# Altium schematic sheet Sheet1.SchDoc
size B; SheetNumber: 1; SheetTotal: 1
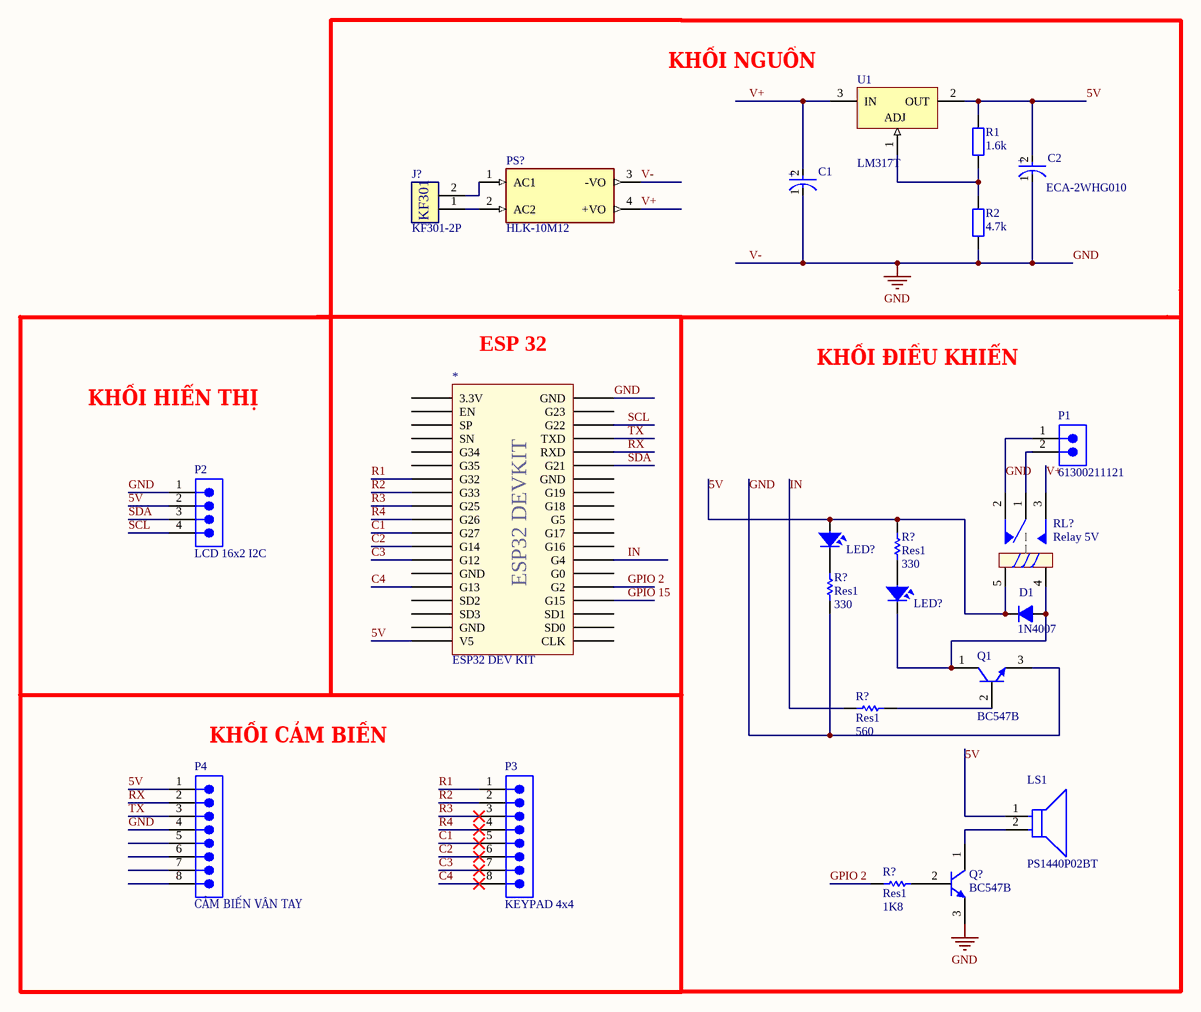
[diagram p0: Sheet1.SchDoc]

## Parts
(Parts that share a designator on the sheet are numbered #1, #2 ... from top to bottom, then left to right.)
*  ESP32 DEV KIT  [ESP32 DEVKIT]
C1  EEUED2G100  [FP-RAD-TH-D_10_0_5-L_20_2-MFG]  (value not drawn)
C2  ECA-2WHG010  [FP-ECA-2WHG010-MFG]
D1  1N4007  [D1A]
J?  KF301-2P  [KF301-5.0-2P]
LED?#1  LED  [LED-3]  (value not drawn)
LED?#2  LED  [LED-3]  (value not drawn)
LS1  PS1440P02BT  [FP-PS1440P02BT-MFG]
P1  61300211121  [61300211121]
P2  LCD 16x2 I2C  [61300411121]
P3  KEYPAD 4x4  [61300811121]
P4  CẢM BIẾN VÂN TAY  [61300811121]
PS?  HLK-10M12  [CONV_HLK-10M12]
Q1  BC547B  [ONSC-TO-92-3-29-11]
Q?  BC547B  [ONSC-TO-92-3-29-11]
R1  1.6k  [R1/4W]
R2  4.7k  [R1/4W]
R?#1  Res1  value 330  [AXIAL-0.3]
R?#2  Res1  value 330  [AXIAL-0.3]
R?#3  Res1  value 560  [AXIAL-0.3]
R?#4  Res1  value 1K8  [AXIAL-0.3]
RL?  Relay 5V  [RL_SPDT_10A]
U1  LM317T  [NDE0003A]

## Blocks framed on the sheet
ESP 32: *

## Nets
GND: *.38(GND) C1.1(C) C2.1(C) P1.1 P2.1 P4.4 PS?.3(-VO) Q1.3(E) Q?.3(E) R2.1 R?#2.1 RL?.2  [also labelled V-]
5V: *.19(V5) C2.2(A) D1.2(K) LED?#1.1 LS1.1 P2.2 P4.1 R1.2 R?#1.2 RL?.5 U1.2(OUT)
C1: *.11(G27) P3.5
C2: *.12(G14) P3.6
C3: *.13(G12) P3.7
C4: *.15(G13) P3.8
GPIO 2: *.24(G2) R?#4.1
GPIO 15: *.23(G15)
IN: *.26(G4) R?#3.1
R1: *.7(G32) P3.1
R2: *.8(G33) P3.2
R3: *.9(G25) P3.3
R4: *.10(G26) P3.4
RX: *.34(RXD) P4.2
SCL: *.36(G22) P2.4
SDA: *.33(G21) P2.3
TX: *.35(TXD) P4.3
V+: C1.2(A) PS?.4(+VO) RL?.3 U1.3(IN)
NetD1_1: D1.1(A) LED?#2.2 Q1.1(C) RL?.4
NetJ?_1: J?.1 PS?.2(AC2)
NetJ?_2: J?.2 PS?.1(AC1)
NetLED?#1_2: LED?#1.2 R?#2.2
NetLED?#2_1: LED?#2.1 R?#1.1
NetLS1_2: LS1.2 Q?.1(C)
NetP1_2: P1.2 RL?.1
NetQ1_2: Q1.2(B) R?#3.2
NetQ?_2: Q?.2(B) R?#4.2
NetR1_1: R1.1 R2.2 U1.1(ADJ)

Not connected (* = marked no-connect by the designer): * 1(3.3V) 2(EN) 3(SP) 4(SN) 5(G34) 6(G35) 14(GND) 16(SD2) 17(SD3) 18(GND) 20(CLK) 21(SD0) 22(SD1) 25(G0) 27(G16) 28(G17) 29(G5) 30(G18) 31(G19) 32(GND) 37(G23); P4 5 6 7 8

## Notes on the sheet
- KHỐI NGUỒN
- KHỐI ĐIỀU KHIỂN
- KHỐI HIỂN THỊ
- (near P4) KHỐI CẢM BIẾN
- (in symbol CMP-00287-55558411-1) +
- (in symbol CMP-05427-001613-1) +
- (in symbol ESP32 DEV KIT) ESP32 DEVKIT
- (in symbol KF301-2P) KF301

## Library data of the parts
C1 = CMP-05427-001613-1: Aluminum Electrolytic Capacitors (Radial Lead Type) 10uF ±20% 400V; Lead Diameter: 0.6mm; Life (Hours): 8000Hour; Ripple Current (AC): 300mA; Dissipation Factor: 0.24%; Dielectric Material: Aluminium; Polarity: Polar; Voltage: 400V; Number of Pins: 2; Height: 20mm; Case/Package: Radial; REACH SVHC: No SVHC; Max Operating Temperature: 105°C; Construction: RADIAL; Voltage Rating (DC): 400V; Tolerance: 20%; Voltage Rating: 400V; Contact Plating: Tin; Ripple Current: 300mA; Min Operating Temperature: -25°C; Packaging: Bulk; Lead Free: Lead Free; Diameter: 10mm; Height - Seated (Max): 0.787inch; Radiation Hardening: No; Capacitance: 10uF; Termination: Radial; Length: 20mm; Series: ED; Package Quantity: 200; Mount: Through Hole; Lead Pitch: 5mm; RoHS Compliant: Yes
C2 = CMP-00287-55558411-1: ECA-2WHG010 Aluminum Electrolytic Capacitor, 1 uF, 450 V, ± 20%, 2000 hours @ 105°C, Radial Leaded; Dielectric Material: Aluminium; Voltage Rating: 450V; Capacitance: 1µF; Dissipation Factor: 0.24%; Lead Diameter: 600µm; Ripple Current: 18mA; Lead/Base Style: Straight; Packaging: Bulk; Width: 8mm; Lead Pitch: 3.5mm; Termination: Radial; Contact Plating: Tin; Length: 11.5mm; Radiation Hardening: No; Voltage Rating (DC): 450V; Max Operating Temperature: 105°C; REACH SVHC: No SVHC; Min Operating Temperature: -25°C; Diameter: 8mm; RoHS: Compliant; Mount: PCB, Through Hole; Tolerance: 20%; Schedule B: 8532220020, 8532220020; Height: 11.5mm; Lead Free: Lead Free; Number of Pins: 2; Height - Seated (Max): 12.4968mm; Life (Hours): 2000hours; Voltage: 450V; Voltage Rating (AC): 450V; NexarPartId: 55558411; Case/Package: Radial; Supplier 1: Arrow Electronics
D1 = D1A: Diode 1A; Value: 1N4007
LED?#1 LED?#2 = LED: LED Single colour Green and Red; Value: LED 3 ly Single Colour
LS1 = CMP-08413-000003-1: AUDIO PIEZO TRANSDUCER 30V TH; Self Resonant Frequency: 4kHz; Washable: No; Voltage Rating (DC): 3V; Number of Terminals/Pins: 2; Packaging: Tape and Reel; Lead Free: Lead Free; Min Operating Temperature: -10°C; Package Quantity: 350; Termination: PC Pins; Mount: Through Hole; Max Operating Temperature: 70°C; Operating Supply Voltage: 3V; Diameter: 14mm; RoHS Compliant: Yes; Frequency: 4kHz; Height: 8mm
P1 = CMP-1712-00002-6: NexarPartId: 20081794; Number of Contacts: 2; Pitch: 2.54mm; Connector Type: Male Pin; Voltage Rating: 250V; Current Rating: 3A; Gender: Male; Contact Resistance: 20mΩ; Height: 8.94mm; Lead Free: Lead Free; Number of Pins: 2; Termination: Through Hole; RoHS: Compliant; Lead Pitch: 2.54mm; REACH SVHC: No SVHC; Housing Material: PBT; Contact Mating Length: 5.9944mm; Min Operating Temperature: -40°C; Orientation: Vertical; Contact Material: Copper; Contact Gender: Male; Max Operating Temperature: 125°C; Number of Rows: 1; Number of Positions: 2; Packaging: Bulk; Contact Plating: Gold; Mount: Through Hole; Color: Black; Operating Supply Voltage: 250V
P2 = CMP-1502-01064-3: NexarPartId: 32855522; Operating Supply Voltage: 250V; Pitch: 2.54mm; Contact Resistance: 20mΩ; Number of Positions: 4; Current Rating: 3A; Connector Type: Male Pin; Gender: Male; Contact Plating: Gold; Height: 8.89mm; Lead Pitch: 2.54mm; Lead Free: Lead Free; Contact Mating Length: 5.9944mm; Number of Rows: 1; Termination: Solder; Packaging: Bulk; REACH SVHC: Unknown; Min Operating Temperature: -40°C; RoHS: Compliant; Number of Contacts: 4; Voltage Rating: 250V; Color: Black; Max Operating Temperature: 105°C; Contact Material: Copper; Mount: Through Hole; Orientation: Vertical; Number of Pins: 4
P3 P4 = CMP-1502-01076-3: NexarPartId: 32855533; Connector Type: Male Pin; Number of Contacts: 8; Voltage Rating: 250V; Current Rating: 3A; Contact Resistance: 20mΩ; Pitch: 2.54mm; Gender: Male; Termination: Solder; Contact Material: Copper; Mount: Through Hole; Lead Pitch: 2.54mm; Number of Positions: 8; Operating Supply Voltage: 250V; Number of Pins: 8; Max Operating Temperature: 105°C; Height: 8.54mm; REACH SVHC: Unknown; Number of Rows: 1; Packaging: Bulk; Contact Plating: Gold; Contact Mating Length: 5.9944mm; Orientation: Vertical; RoHS: Compliant; Color: Black; Min Operating Temperature: -40°C
PS? = HLK-10M12: 10W Ultra-Compact Power Module; MF: Hi-link; SnapEDA_Link: https://www.snapeda.com/parts/HLK-10M12/Hi-link/view-part/?ref=snap; Package: Package; Value: *; MP: HLK-10M12; Check_prices: https://www.snapeda.com/parts/HLK-10M12/Hi-link/view-part/?ref=eda
Q1 Q? = CMP-1048-01467-1: Amplifier Transistor, NPN Silicon, 3-Pin TO-92, Bulk Box; Manufacturer: On Semiconductor; IC Continuous (A): 0.1; fT Min (MHz): 150; DatasheetVersion: Rev. 7; ComponentLink1URL: http://www.onsemi.com/; Polarity: NPN; RoHS: FALSE; ComponentLink1Description: Manufacturer URL; Packing: Bulk Box; PackageDescription: 3-Pin Transistor Outline, Body 4.825 x 3.685 mm, Pitch 1.27 mm; ComponentLink3URL: http://www.onsemi.cn/pub_link/Collateral/2N6426-D.PDF; ComponentLink2Description: Datasheet; PackageVersion: Rev. AM; PackageReference: TO-92-3-29-11_AM_SL; ComponentLink3Description: Package Specification; Mounting Technology: Through Hole; PartNumber: BC547B; ComponentLink2URL: http://www.onsemi.com/pub_link/Collateral/BC546-D.PDF
R1 R2 = R1/4W: Resistor 1/4W; Value: R1/4W - 1K
R?#1-R?#4 = Res1: Resistor; Published: 8-Jun-2000; LatestRevisionDate: 17-Jul-2002; LatestRevisionNote: Re-released for DXP Platform.; PackageReference: AXIAL-0.3; Publisher: Altium Limited; PackageDescription: Axial Device, Thru-Hole; 2 Leads; 0.3 in Pin Spacing
RL? = Relay 1: Relay SPDT,10A - 12VDC 5 Pin; Value: Relay SPDT, 10A, 12V
U1 = CMP-0062-02456-3: 3-Terminal Adjustable Regulator, 3-pin TO-220; Manufacturer: Texas Instruments; CompType: LDO IC; PowerWise: N; PackageTopMarking: NSUZXYTTE#*LM317T P+; ComponentLink1Description: Datasheet URL; PackageReference: NDE0003A; PinCount: 3; ComponentLink1URL: http://www.ti.com/general/docs/lit/getliterature.tsp?genericPartNumber=LM317-N&fileType=pdf; RoHS: N; PackageDescription: TO-220, Molded, 3 Lead, Straight